# Altium project power_dist.PrjPCB
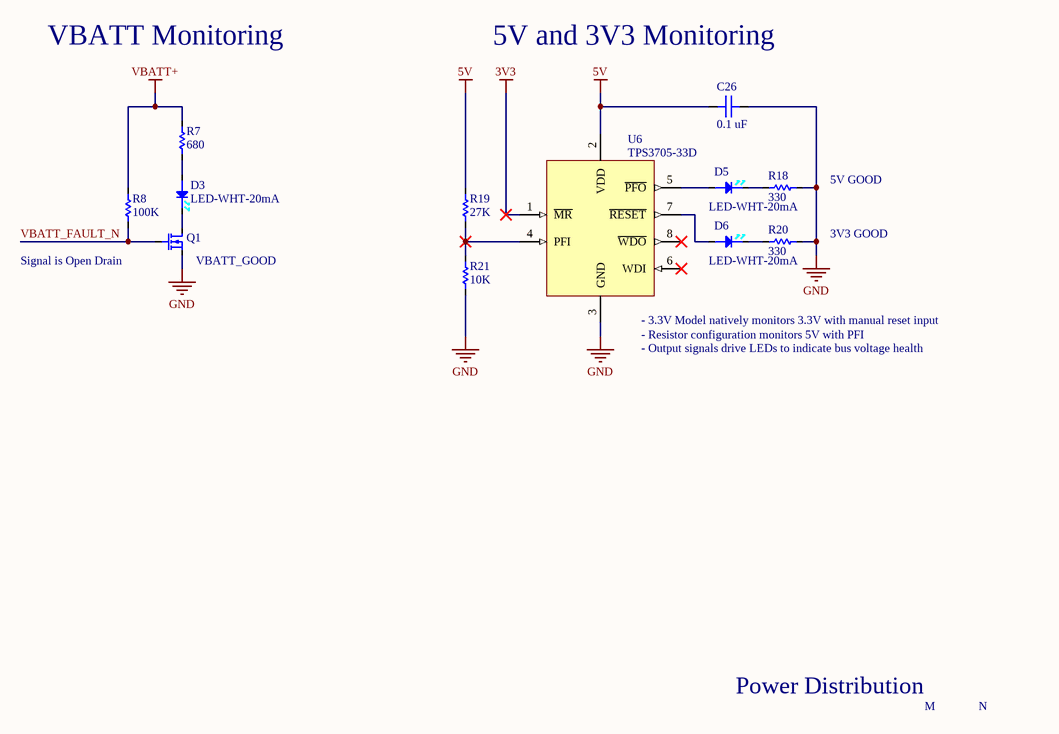
[diagram p0: monitoring.SchDoc]
4 sheets, 66 parts. Net scope: global (net labels, ports and power ports of the same name join across sheets).
Board file: power_dist.PcbDoc
Sheets:
  monitoring.SchDoc
  raw_input.SchDoc
  outputs.SchDoc
  low_voltage_rails.SchDoc

## Sheet monitoring.SchDoc: Fault-Tolerant Quadcopter
size A; DrawnBy: Vaughn Kottler; Engineer: Vaughn Kottler; Revision: A

### Parts
C26  0.1 uF  [CAP-CER-0805-SHORT]
D3  LED-WHT-20mA  [LED-0805]
D5  LED-WHT-20mA  [LED-0805]
D6  LED-WHT-20mA  [LED-0805]
Q1  2N7002K  [SOT-23-3]  (value not drawn)
R7  680  [RES-0805]
R8  100K  [RES-0805]
R18  330  [RES-0805]
R19  27K  [RES-0805]
R20  330  [RES-0805]
R21  10K  [RES-0805]
U6  Manufacturer Part Number: TPS3705-33D  [8SOIC]  (hidden comment: IC_TPS3705-33DGN.1)

### Nets
3V3: U6.1(~{MR})
5V: C26.1 R19.2 U6.2(VDD)
GND: C26.2 Q1.2(S) R18.2 R20.2 R21.1 U6.3(GND)
VBATT+: R7.2 R8.2
VBATT_FAULT_N: Q1.1(G) R8.1
NetD3_1: D3.1(CT) R7.1
NetD3_2: D3.2(AN) Q1.3(D)
NetD5_1: D5.1(CT) U6.5(~{PFO})
NetD5_2: D5.2(AN) R18.1
NetD6_1: D6.1(CT) U6.7(~{RESET})
NetD6_2: D6.2(AN) R20.1
NetR19_1: R19.1 R21.2 U6.4(PFI)

Not connected (* = marked no-connect by the designer): U6 6(WDI)* 8(~{WDO})*

### Notes on the sheet
- VBATT Monitoring
- 5V and 3V3 Monitoring
- (near R18) 5V GOOD
- 3V3 GOOD
- Signal is Open Drain
- (near Q1) VBATT_GOOD
- (near U6) - 3.3V Model natively monitors 3.3V with manual reset input
- (near U6) - Resistor configuration monitors 5V with PFI
- (near U6) - Output signals drive LEDs to indicate bus voltage health
- Power Distribution
- M
- N

### Library data of the parts
C26 = CAP-CER-0.1uF-25V: 10%, 0805; ComponentLink1Description: Capacitor Book (Amazon); ComponentLink1URL: https://www.amazon.com/gp/product/B0728HBDRW/
D3 D5 D6 = LED-WHT-20mA: 2.2V, 0805; ComponentLink1Description: Resistor Book (Amazon); ComponentLink1URL: https://www.amazon.com/gp/product/B071J21FYF/; Supplier 1: Digi-Key; Supplier Part Number 1: 475-1410-1-ND
Q1 = NMOS-2.0VT-60VDS-300mA: N-Channel, SOT-23; ComponentLink1Description: Datasheet; ComponentLink1URL: https://www.rohm.com/datasheet/RE1C002UN/re1c002untcl-e; Supplier 1: Digi-Key; Supplier Part Number 1: 2N7002K-T1-E3DKR-ND
R7 = RES-680-1/8W: 0805; ComponentLink1Description: Resistor Book (Amazon); ComponentLink1URL: https://www.amazon.com/gp/product/B071J21FYF/
R8 = RES-100K-1/8W: 0805; ComponentLink1Description: Resistor Book (Amazon); ComponentLink1URL: https://www.amazon.com/gp/product/B071J21FYF/
R18 R20 = RES-330-1/8W: 0805; ComponentLink1Description: Resistor Book (Amazon); ComponentLink1URL: https://www.amazon.com/gp/product/B071J21FYF/
R19 = RES-27K-1/8W: 0805; ComponentLink1Description: Resistor Book (Amazon); ComponentLink1URL: https://www.amazon.com/gp/product/B071J21FYF/
R21 = RES-10K-1/8W: 0805; ComponentLink1Description: Resistor Book (Amazon); ComponentLink1URL: https://www.amazon.com/gp/product/B071J21FYF/
U6 = IC_TPS3705-33DGN.1: IC 2.93V PROCESSOR MONITOR 8MSOP; Manufacturer: Texas Instruments; Number of Voltages Monitored: 1; Output: Push-Pull, Totem Pole; Reset: Active Low; Reset Timeout: 140 ms Minimum; Supplier 1: Digi-Key; RoHS: RoHS Compliant; Category: Integrated Circuits (ICs); Stock 1: 1844; Pricing 1: 1=2.04, 10=1.831, 100=1.4718, 500=1.20926, 1000=1.00195, 2500=0.93285, 5000=0.8983, 10000=0.86375 (USD); Packaging: Tube; Part Status: Active; Type: Simple Reset/Power-On Reset; Voltage - Threshold: 2.93V; Operating Temperature: -40°C ~ 85°C (TA); Mounting Type: Surface Mount; Package / Case: 8-SOIC (0.154", 3.90mm Width); Supplier Device Package: 8-SOIC; ComponentLink1URL: http://www.ti.com/lit/ds/symlink/tps3705.pdf; ComponentLink1Description: Datasheet; Supplier Part Number 1: 296-2623-5-ND

## Sheet raw_input.SchDoc: Fault-Tolerant Quadcopter
size A; DrawnBy: Vaughn Kottler; Engineer: Vaughn Kottler; Revision: A
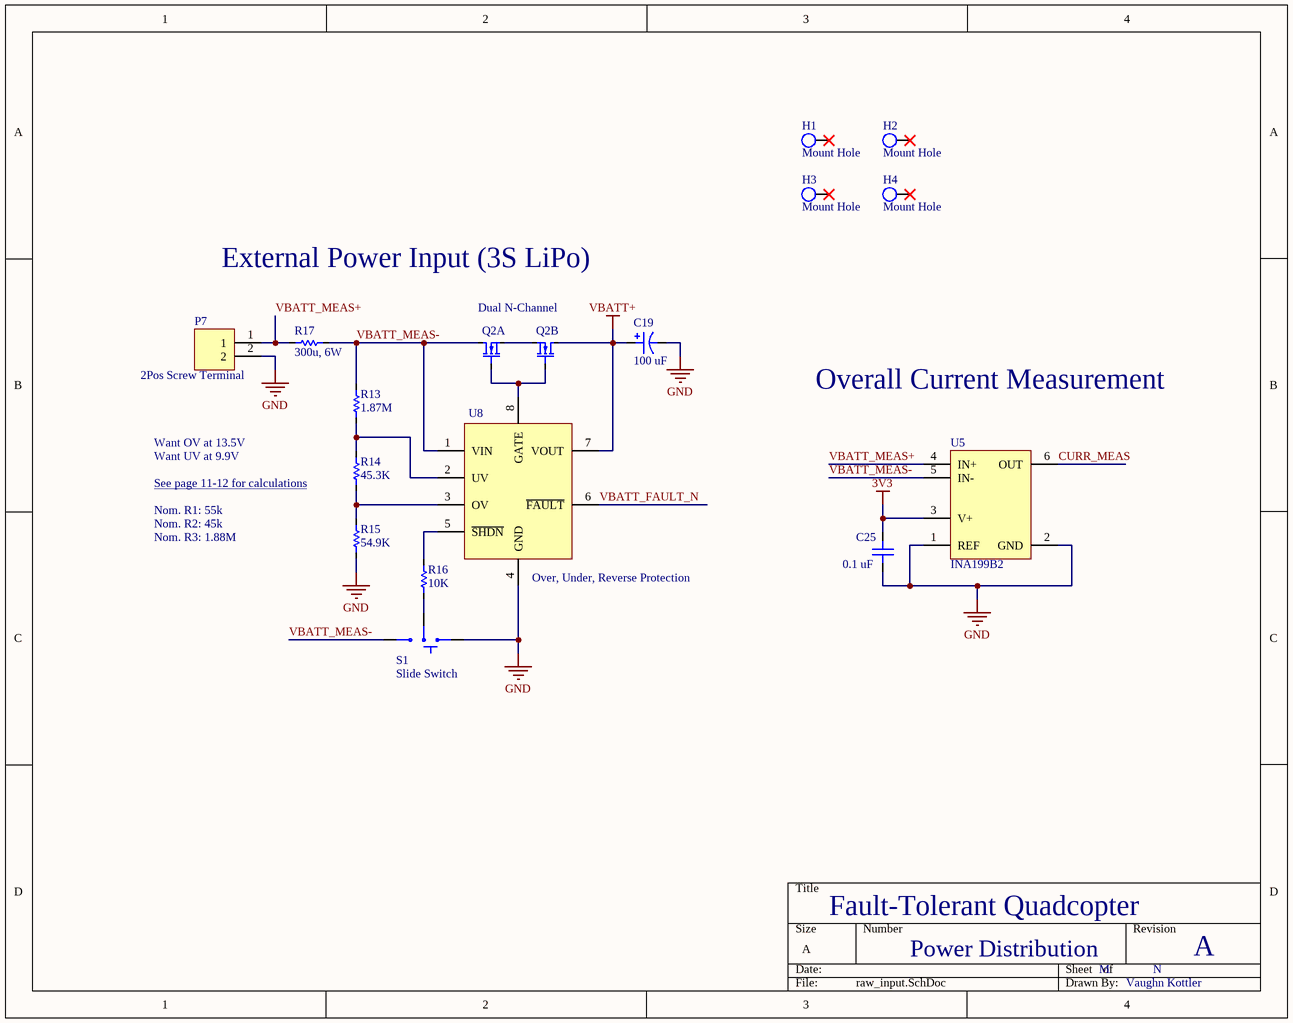
[diagram p1: raw_input.SchDoc]

### Parts
C19  100 uF  [CAP-CAN-8.3x8.3]
C25  0.1 uF  [CAP-CER-0805-SHORT]
H1  Mount Hole  [4mm Mount Hole]
H2  Mount Hole  [4mm Mount Hole]
H3  Mount Hole  [4mm Mount Hole]
H4  Mount Hole  [4mm Mount Hole]
P7  2Pos Screw Terminal  [2Pos Screw Terminal]
Q2  Dual N-Channel  [PowerPAK 8x8L]  (parts A,B of 2)
R13  1.87M  [RES-0805]
R14  45.3K  [RES-0805]
R15  54.9K  [RES-0805]
R16  10K  [RES-0805]
R17  300u, 6W  [RES-SHNT-2512]
S1  Slide Switch  [SMT Slide Switch RA]
U5  INA199B2  [SC70]
U8  Over, Under, Reverse Protection  [SOT-23-8]

### Nets
3V3: C25.2 U5.3(V+)
GND: C19.2 C25.1 P7.2 R15.1 S1.1(L) U5.1(REF) U5.2(GND) U8.4(GND)
VBATT+: C19.1 Q2.D2 U8.7(VOUT)
CURR_MEAS: U5.6(OUT)
VBATT_FAULT_N: U8.6(~{FAULT})
VBATT_MEAS+: P7.1 R17.1 U5.4(IN+)
VBATT_MEAS-: Q2.D1 R13.2 R17.2 S1.3(R) U5.5(IN-) U8.1(VIN)
NetQ2_G1: Q2.G1 Q2.G2 U8.8(GATE)
NetQ2_S1: Q2.S1 Q2.S2
NetR13_1: R13.1 R14.2 U8.2(UV)
NetR14_1: R14.1 R15.2 U8.3(OV)
NetR16_1: R16.1 S1.2(COM)
NetR16_2: R16.2 U8.5(~{SHDN})

Not connected (* = marked no-connect by the designer): H1 H*; H2 H*; H3 H*; H4 H*

### Notes on the sheet
- External Power Input (3S LiPo)
- Overall Current Measurement
- Want OV at 13.5V
- Want UV at 9.9V
- (near R14) See page 11-12 for calculations <https://www.analog.com/media/en/technical-documentation/data-sheets/4365fa.pdf>
- Nom. R1: 55k
- Nom. R2: 45k
- Nom. R3: 1.88M
- Power Distribution
- M
- N

### Library data of the parts
C19 = CAP-CAN-100uF-25V: ±20%, 8.3mm x 8.3mm; Supplier 1: Digi-Key; Supplier Part Number 1: PCE4003DKR-ND
C25 = CAP-CER-0.1uF-25V: 10%, 0805; ComponentLink1Description: Capacitor Book (Amazon); ComponentLink1URL: https://www.amazon.com/gp/product/B0728HBDRW/
P7 = 2Pos Screw Terminal: 0.2" Pitch 1x2
Q2 = SQJQ900E: Dual N-Channel 40V 100A; Supplier 1: Digi-Key; Supplier Part Number 1: SQJQ900E-T1_GE3DKR-ND; ComponentLink1Description: Datasheet; ComponentLink1URL: http://www.vishay.com/docs/62796/sqjq900e.pdf
R13 = RES-1.87M-1/8W: 1%, 0805; Supplier 1: Digi-Key; Supplier Part Number 1: P1.87BTDKR-ND
R14 = RES-45.3K-1/8W: 1%, 0805; Supplier 1: Digi-Key; Supplier Part Number 1: P45.3KCDKR-ND
R15 = RES-54.9K-1/8W: 1%, 0805; Supplier 1: Digi-Key; Supplier Part Number 1: 541-54.9KCDKR-ND
R16 = RES-10K-1/8W: 0805; ComponentLink1Description: Resistor Book (Amazon); ComponentLink1URL: https://www.amazon.com/gp/product/B071J21FYF/
R17 = RES-300u-6W: 2512, 1%; Supplier 1: Digi-Key; ComponentLink1Description: Datasheet; ComponentLink1URL: http://www.vishay.com/docs/30193/wslf.pdf; Supplier Part Number 1: 541-3123-6-ND
S1 = SMT Slide Switch: 2mm Pitch; Supplier 1: Digi-Key; Supplier Part Number 1: 360-2924-1-ND
U5 = INA199B2: 100 V/V, Current-Shunt Monitor; ComponentLink1Description: Datasheet; ComponentLink1URL: http://www.ti.com/lit/ds/symlink/ina199.pdf; Supplier 1: Digi-Key; Supplier Part Number 1: INA199B2DCKR-ND
U8 = LTC4365: Overvoltage, Undervoltage and Reverse Supply Protection Controller; Supplier 1: Digi-Key; Supplier Part Number 1: LTC4365CTS8#TRMPBFDKR-ND; ComponentLink1Description: Datasheet; ComponentLink1URL: https://www.analog.com/media/en/technical-documentation/data-sheets/4365fa.pdf

## Sheet outputs.SchDoc: Fault-Tolerant Quadcopter
size A; DrawnBy: Vaughn Kottler; Engineer: Vaughn Kottler; Revision: A
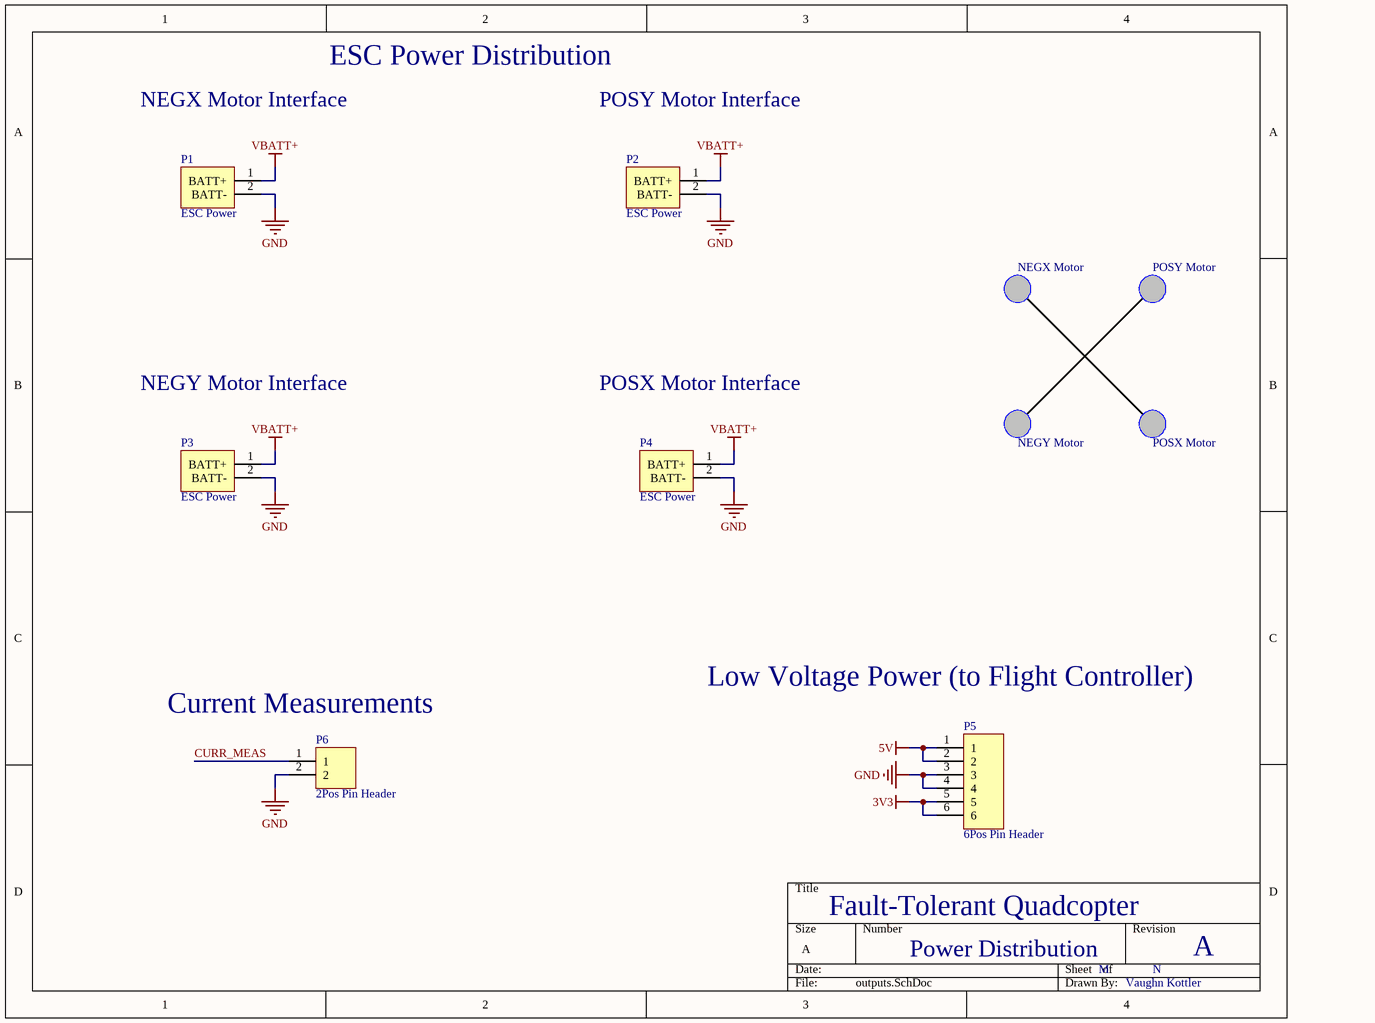
[diagram p2: outputs.SchDoc]

### Parts
P1  ESC Power  [2Pos Screw Terminal]
P2  ESC Power  [2Pos Screw Terminal]
P3  ESC Power  [2Pos Screw Terminal]
P4  ESC Power  [2Pos Screw Terminal]
P5  6Pos Pin Header  [6Pos Pin Header JST]
P6  2Pos Pin Header  [2Pos Pin Header JST]

### Nets
3V3: P5.5 P5.6
5V: P5.1 P5.2
GND: P1.2(BATT-) P2.2(BATT-) P3.2(BATT-) P4.2(BATT-) P5.3 P5.4 P6.2
VBATT+: P1.1(BATT+) P2.1(BATT+) P3.1(BATT+) P4.1(BATT+)
CURR_MEAS: P6.1

### Notes on the sheet
- ESC Power Distribution
- NEGX Motor Interface
- POSY Motor Interface
- NEGX Motor
- POSY Motor
- NEGY Motor Interface
- POSX Motor Interface
- NEGY Motor
- POSX Motor
- Low Voltage Power (to Flight Controller)
- (near P6) Current Measurements
- Power Distribution
- M
- N

### Library data of the parts
P1-P4 = ESC Power: 0.2" Pitch 1x2
P5 = 6Pos Pin Header: 0.1" Pitch 1x6
P6 = 2Pos Pin Header: 0.1" Pitch 1x2

## Sheet low_voltage_rails.SchDoc: Fault-Tolerant Quadcopter
size A; DrawnBy: Vaughn Kottler; Engineer: Vaughn Kottler; Revision: A
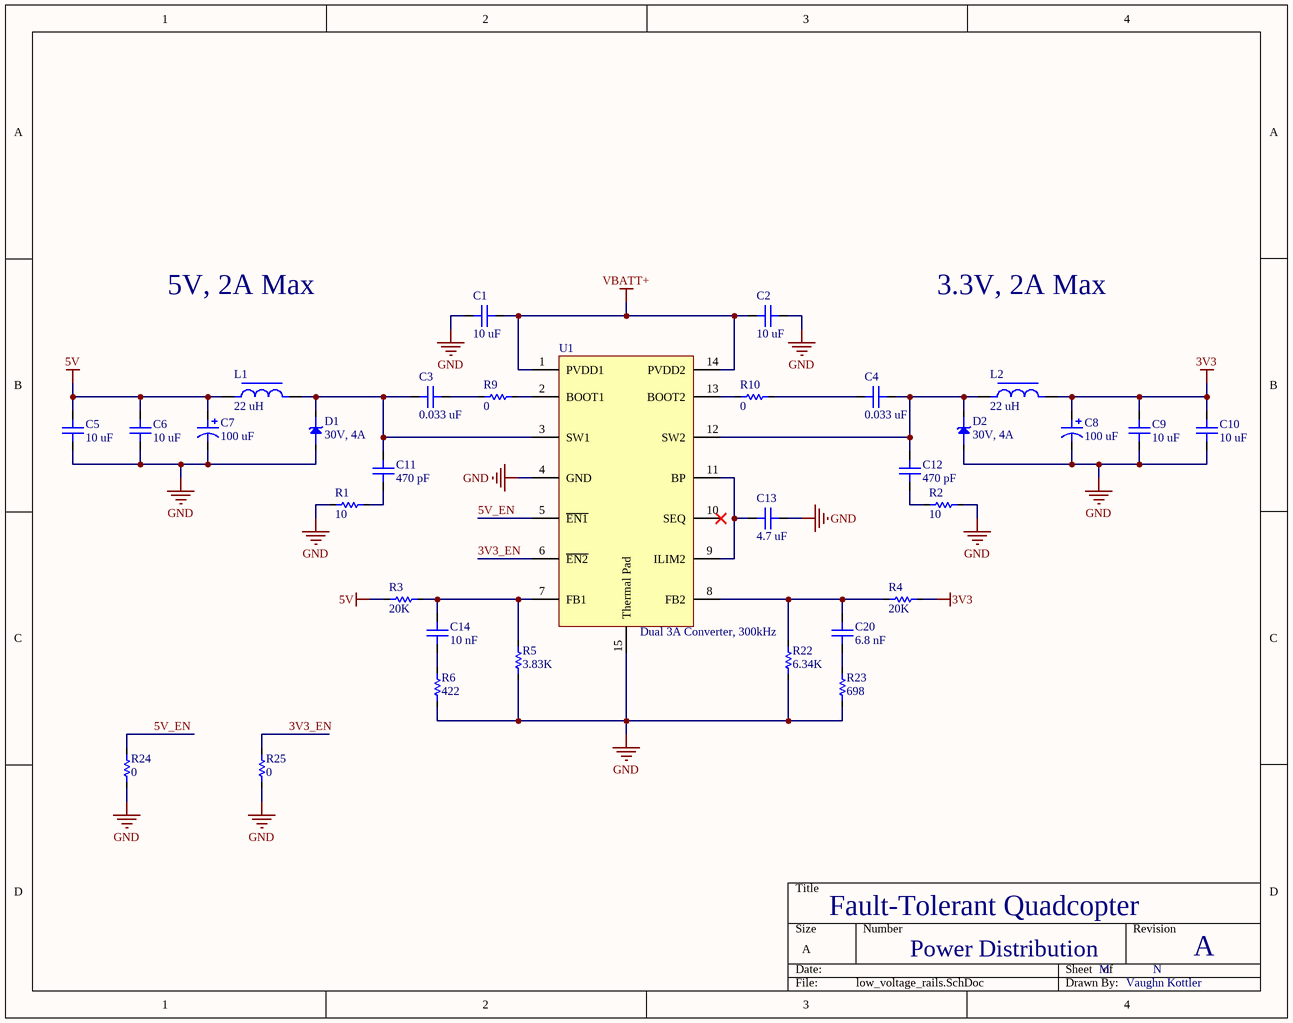
[diagram p3: low_voltage_rails.SchDoc]

### Parts
C1  10 uF  [CAP-CER-1206]
C2  10 uF  [CAP-CER-1206]
C3  0.033 uF  [CAP-CER-0603]
C4  0.033 uF  [CAP-CER-0603]
C5  10 uF  [CAP-CER-0805-TALL]
C6  10 uF  [CAP-CER-0805-TALL]
C7  100 uF  [CAP-CAN-8.3x8.3]
C8  100 uF  [CAP-CAN-8.3x8.3]
C9  10 uF  [CAP-CER-0805-TALL]
C10  10 uF  [CAP-CER-0805-TALL]
C11  470 pF  [CAP-CER-0603]
C12  470 pF  [CAP-CER-0603]
C13  4.7 uF  [CAP-CER-0805-TALL]
C14  10 nF  [CAP-CER-0603]
C20  6.8 nF  [CAP-CER-0603]
D1  30V, 4A  [DO-214AB-SMC]
D2  30V, 4A  [DO-214AB-SMC]
L1  22 uH  [IND-12mm]
L2  22 uH  [IND-12mm]
R1  10  [RES-0603]
R2  10  [RES-0603]
R3  20K  [RES-0603]
R4  20K  [RES-0603]
R5  3.83K  [RES-0603]
R6  422  [RES-0603]
R9  0  [RES-0603]
R10  0  [RES-0603]
R22  6.34K  [RES-0603]
R23  698  [RES-0603]
R24  0  [RES-0805]
R25  0  [RES-0805]
U1  Dual 3A Converter, 300kHz  [14-HTSSOP]

### Nets
3V3: C8.1 C9.2 C10.2 L2.2 R4.2
5V: C5.2 C6.2 C7.1 L1.1 R3.1
GND: C1.1 C2.2 C5.1 C6.1 C7.2 C8.2 C9.1 C10.1 C13.1 D1.1(CT) D2.1(CT) R1.2 R2.1 R5.1 R6.1 R22.1 R23.1 R24.1 R25.1 U1.4(GND) U1.15(Thermal_Pad)
VBATT+: C1.2 C2.1 U1.1(PVDD1) U1.14(PVDD2)
3V3_EN: R25.2 U1.6(~{EN2})
5V_EN: R24.2 U1.5(~{EN1})
NetC3_1: C3.1 C11.2 D1.2(AN) L1.2 U1.3(SW1)
NetC3_2: C3.2 R9.1
NetC4_1: C4.1 R10.2
NetC4_2: C4.2 C12.2 D2.2(AN) L2.1 U1.12(SW2)
NetC11_1: C11.1 R1.1
NetC12_1: C12.1 R2.2
NetC13_2: C13.2 U1.9(ILIM2) U1.11(BP)
NetC14_1: C14.1 R6.2
NetC14_2: C14.2 R3.2 R5.2 U1.7(FB1)
NetC20_1: C20.1 R23.2
NetC20_2: C20.2 R4.1 R22.2 U1.8(FB2)
NetR9_2: R9.2 U1.2(BOOT1)
NetR10_1: R10.1 U1.13(BOOT2)

Not connected (* = marked no-connect by the designer): U1 10(SEQ)*

### Notes on the sheet
- 5V, 2A Max
- 3.3V, 2A Max
- Power Distribution
- M
- N

### Library data of the parts
C1 C2 = CAP-CER-10uF-25V-1206: ±20%, 1206; ComponentLink1Description: Datasheet; ComponentLink1URL: https://search.murata.co.jp/Ceramy/image/img/A01X/G101/ENG/GRM21BR61E106KA73-01.pdf; Supplier 1: Digi-Key; Supplier Part Number 1: 445-14678-6-ND
C3 C4 = CAP-CER-0.033uF-25V: 10%, 0603; Supplier 1: Digi-Key; Supplier Part Number 1: 1276-6675-6-ND
C5 C6 C9 C10 = CAP-CER-10uF-25V: ±10%, 0805; Supplier 1: Digi-Key; ComponentLink1Description: Datasheet; ComponentLink1URL: https://search.murata.co.jp/Ceramy/image/img/A01X/G101/ENG/GRM21BR61E106KA73-01.pdf; Supplier Part Number 1: 490-5523-6-ND
C7 C8 = CAP-CAN-100uF-10V: ±20%, 8.3mm x 8.3mm; Supplier 1: Digi-Key; Supplier Part Number 1: PCE3989DKR-ND
C11 C12 = CAP-CER-470pF-50V: 20%, 0603; Supplier 1: Digi-Key; Supplier Part Number 1: 311-3377-6-ND
C13 = CAP-CER-4.7uF-10V: ±10%, 0805; ComponentLink1Description: Capacitor Book (Amazon); ComponentLink1URL: https://www.amazon.com/gp/product/B0728HBDRW/
C14 = CAP-CER-10nF-25V: ±20%, 0603; Supplier 1: Digi-Key; Supplier Part Number 1: 399-8989-6-ND
C20 = CAP-CER-6.8nF-25V: ±10%, 0603; Supplier 1: Digi-Key; Supplier Part Number 1: 732-7982-6-ND
D1 D2 = DIO-500mV-30V-4A: Schottky, SMC (DO-214AB); ComponentLink1Description: Resistor Book (Amazon); ComponentLink1URL: https://www.amazon.com/gp/product/B071J21FYF/; Supplier 1: Digi-Key; Supplier Part Number 1: MBRS330T3GOSDKR-ND
L1 L2 = IND-22uH-38m-5.2A: ±20%, 8 MHz res; Supplier 1: Digi-Key; Supplier Part Number 1: SRR1210-220MDKR-ND; ComponentLink1Description: Datasheet; ComponentLink1URL: https://www.bourns.com/docs/Product-Datasheets/SRR1210.pdf
R1 R2 = RES-10-1/4W: 5%, 0603; Supplier 1: Digi-Key; Supplier Part Number 1: RHM10DDKR-ND
R3 R4 = RES-20K-1/10W: 1%, 0603; Supplier 1: Digi-Key; Supplier Part Number 1: P20.0KHDKR-ND
R5 = RES-3.83K-1/10W: 1%, 0603; Supplier 1: Digi-Key; Supplier Part Number 1: P3.83KHDKR-ND
R6 = RES-422-1/10W: 1%, 0603; Supplier 1: Digi-Key; Supplier Part Number 1: 311-422HRCT-ND
R9 R10 = RES-0-1/10W: 0603; Supplier 1: Digi-Key; Supplier Part Number 1: P0.0GDKR-ND
R22 = RES-6.34K-1/10W: 1%, 0603; Supplier 1: Digi-Key; Supplier Part Number 1: 311-6.34KHRDKR-ND
R23 = RES-698-1/10W: 1%, 0603; Supplier 1: Digi-Key; Supplier Part Number 1: RMCF0603FT698RDKR-ND
R24 R25 = RES-0-1/8W: 0805; ComponentLink1Description: Resistor Book (Amazon); ComponentLink1URL: https://www.amazon.com/gp/product/B071J21FYF/
U1 = TPS54383: Dual 3A Non-Synchronous Converters with Integrated High-Side MOSFET; ComponentLink1Description: Datasheet; ComponentLink1URL: http://www.ti.com/lit/ds/symlink/tps54386.pdf; Supplier 1: Digi-Key; Supplier Part Number 1: 296-23087-6-ND

## Nets that join several sheets
3V3: monitoring (U6.1), raw_input (C25.2 U5.3), outputs (P5.5 P5.6), low_voltage_rails (5 pins)
5V: monitoring (C26.1 R19.2 U6.2), outputs (P5.1 P5.2), low_voltage_rails (5 pins)
GND: monitoring (6 pins), raw_input (8 pins), outputs (7 pins), low_voltage_rails (21 pins)
VBATT+: monitoring (R7.2 R8.2), raw_input (C19.1 Q2.D2 U8.7), outputs (P1.1 P2.1 P3.1 P4.1), low_voltage_rails (C1.2 C2.1 U1.1 U1.14)
CURR_MEAS: raw_input (U5.6), outputs (P6.1)
VBATT_FAULT_N: monitoring (Q1.1 R8.1), raw_input (U8.6)